# Altium schematic sheet ControlBoard.SchDoc: Hydroponics Controller
size Letter; Address1: Tyler Menezes; DocumentNumber: 1; Revision: 0.1; SheetNumber: 1; SheetTotal: 1
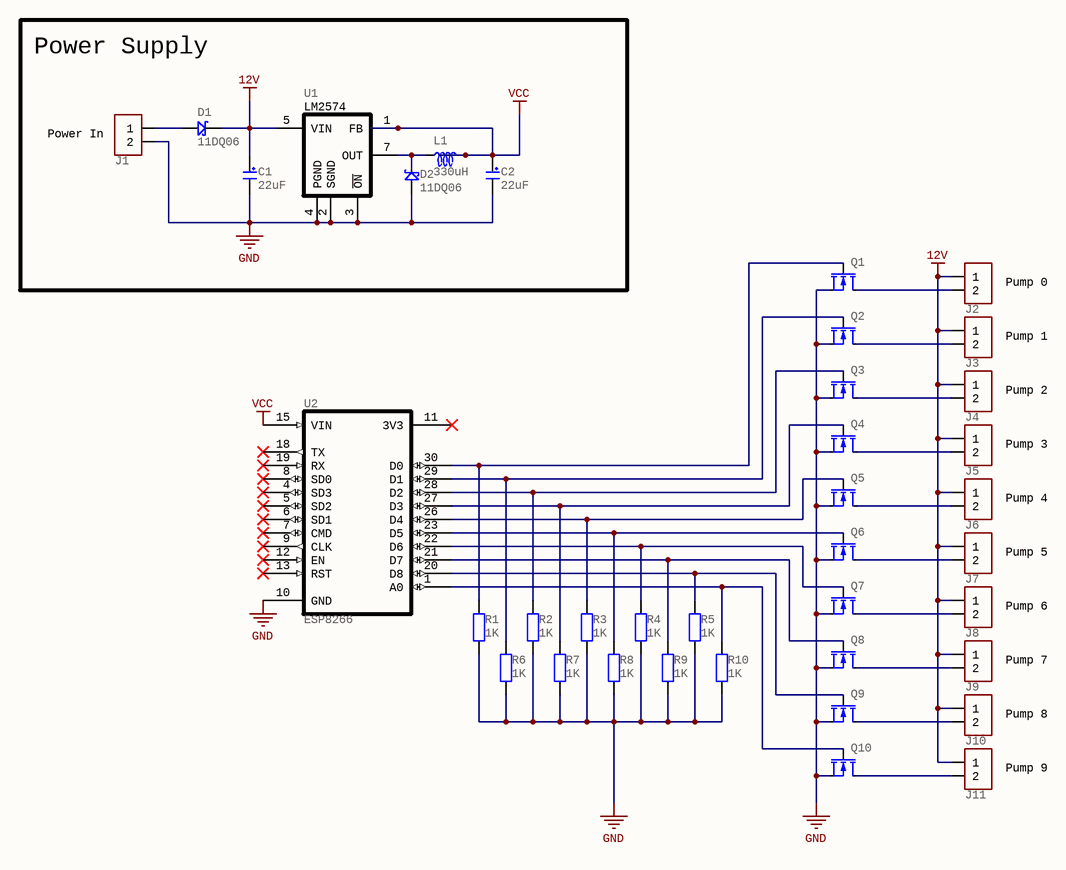
[diagram p0: ControlBoard.SchDoc]

## Parts
C1  value 22uF  [Cap Polarized Radial Small]
C2  value 22uF  [Cap Polarized Radial Small]
D1  PN: 11DQ06  [Diode]
D2  PN: 11DQ06  [Diode]
J1  *  [Header 2x1]  (value not drawn)
J2  *  [Header 2x1]  (value not drawn)
J3  *  [Header 2x1]  (value not drawn)
J4  *  [Header 2x1]  (value not drawn)
J5  *  [Header 2x1]  (value not drawn)
J6  *  [Header 2x1]  (value not drawn)
J7  *  [Header 2x1]  (value not drawn)
J8  *  [Header 2x1]  (value not drawn)
J9  *  [Header 2x1]  (value not drawn)
J10  *  [Header 2x1]  (value not drawn)
J11  *  [Header 2x1]  (value not drawn)
L1  value 330uH  [RES]
Q1  MOSFET-30N06L  [MOSFET N THT]  (value not drawn)
Q2  MOSFET-30N06L  [MOSFET N THT]  (value not drawn)
Q3  MOSFET-30N06L  [MOSFET N THT]  (value not drawn)
Q4  MOSFET-30N06L  [MOSFET N THT]  (value not drawn)
Q5  MOSFET-30N06L  [MOSFET N THT]  (value not drawn)
Q6  MOSFET-30N06L  [MOSFET N THT]  (value not drawn)
Q7  MOSFET-30N06L  [MOSFET N THT]  (value not drawn)
Q8  MOSFET-30N06L  [MOSFET N THT]  (value not drawn)
Q9  MOSFET-30N06L  [MOSFET N THT]  (value not drawn)
Q10  MOSFET-30N06L  [MOSFET N THT]  (value not drawn)
R1  value 1K  [RES]
R2  value 1K  [RES]
R3  value 1K  [RES]
R4  value 1K  [RES]
R5  value 1K  [RES]
R6  value 1K  [RES]
R7  value 1K  [RES]
R8  value 1K  [RES]
R9  value 1K  [RES]
R10  value 1K  [RES]
U1  REG 5V BUCK 2M2574  [PDIP8]  (value not drawn)
U2  ESP8266  [NODEMCU]

## Blocks framed on the sheet
Power Supply: C1 C2 D1 D2 J1 L1 U1

## Nets
12V: C1.A D1.K J2.1 J3.1 J4.1 J5.1 J6.1 J7.1 J8.1 J9.1 J10.1 J11.1 U1.5(VIN)
GND: C1.K C2.K D2.A J1.2 Q1.3(S) Q2.3(S) Q3.3(S) Q4.3(S) Q5.3(S) Q6.3(S) Q7.3(S) Q8.3(S) Q9.3(S) Q10.3(S) R1.2 R2.2 R3.2 R4.2 R5.2 R6.2 R7.2 R8.2 R9.2 R10.2 U1.2(SGND) U1.3(~{ON}) U1.4(PGND) U2.10(GND) U2.14(GND) U2.17(GND) U2.24(GND)
VCC: C2.A L1.2 U1.1(FB) U2.15(VIN)
NetD1_A: D1.A J1.1
NetD2_K: D2.K L1.1 U1.7(OUT)
NetJ2_2: J2.2 Q1.1(D)
NetJ3_2: J3.2 Q2.1(D)
NetJ4_2: J4.2 Q3.1(D)
NetJ5_2: J5.2 Q4.1(D)
NetJ6_2: J6.2 Q5.1(D)
NetJ7_2: J7.2 Q6.1(D)
NetJ8_2: J8.2 Q7.1(D)
NetJ9_2: J9.2 Q8.1(D)
NetJ10_2: J10.2 Q9.1(D)
NetJ11_2: J11.2 Q10.1(D)
NetQ1_2: Q1.2(G) R1.1 U2.30(D0)
NetQ2_2: Q2.2(G) R6.1 U2.29(D1)
NetQ3_2: Q3.2(G) R2.1 U2.28(D2)
NetQ4_2: Q4.2(G) R7.1 U2.27(D3)
NetQ5_2: Q5.2(G) R3.1 U2.26(D4)
NetQ6_2: Q6.2(G) R8.1 U2.23(D5)
NetQ7_2: Q7.2(G) R4.1 U2.22(D6)
NetQ8_2: Q8.2(G) R9.1 U2.21(D7)
NetQ9_2: Q9.2(G) R5.1 U2.20(D8)
NetQ10_2: Q10.2(G) R10.1 U2.1(A0)

Not connected (* = marked no-connect by the designer): U2 2(NC) 3(NC) 4(SD3)* 5(SD2)* 6(SD1)* 7(CMD)* 8(SD0)* 9(CLK)* 11(3V3)* 12(EN)* 13(RST)* 16(3V3) 18(TX)* 19(RX)* 25(3V3)

## Notes on the sheet
- (near J1) Power In
- Pump 0
- Pump 1
- Pump 2
- Pump 3
- Pump 4
- Pump 5
- Pump 6
- Pump 7
- Pump 8
- Pump 9
- Title:
- Number:
- Version:
- File:
- Tyler Menezes
- https://tyler.vc/
- Sheet
- of
- Date:
- Time:
- x@tyler.vc
- (in symbol REG 5V BUCK 2M2574) LM2574

## Library data of the parts
C1 C2 = CAP POLARIZED: Polarized Capacitor
D1 D2 = DIODE SCHOTTKY: Schottky Diode
J1-J11 = CONN 2-PIN
L1 = INDUCTOR
Q1-Q10 = MOSFET-30N06L: N-Channel MOSFET
R1-R10 = RES: Resistor
U1 = REG 5V BUCK 2M2574: 5V Buck Regulator IC
U2 = ESP8266 DEV: ESP8266 Dev Shield